# EAGLE schematic VoltageRegulator (EAGLE 7.2.0)
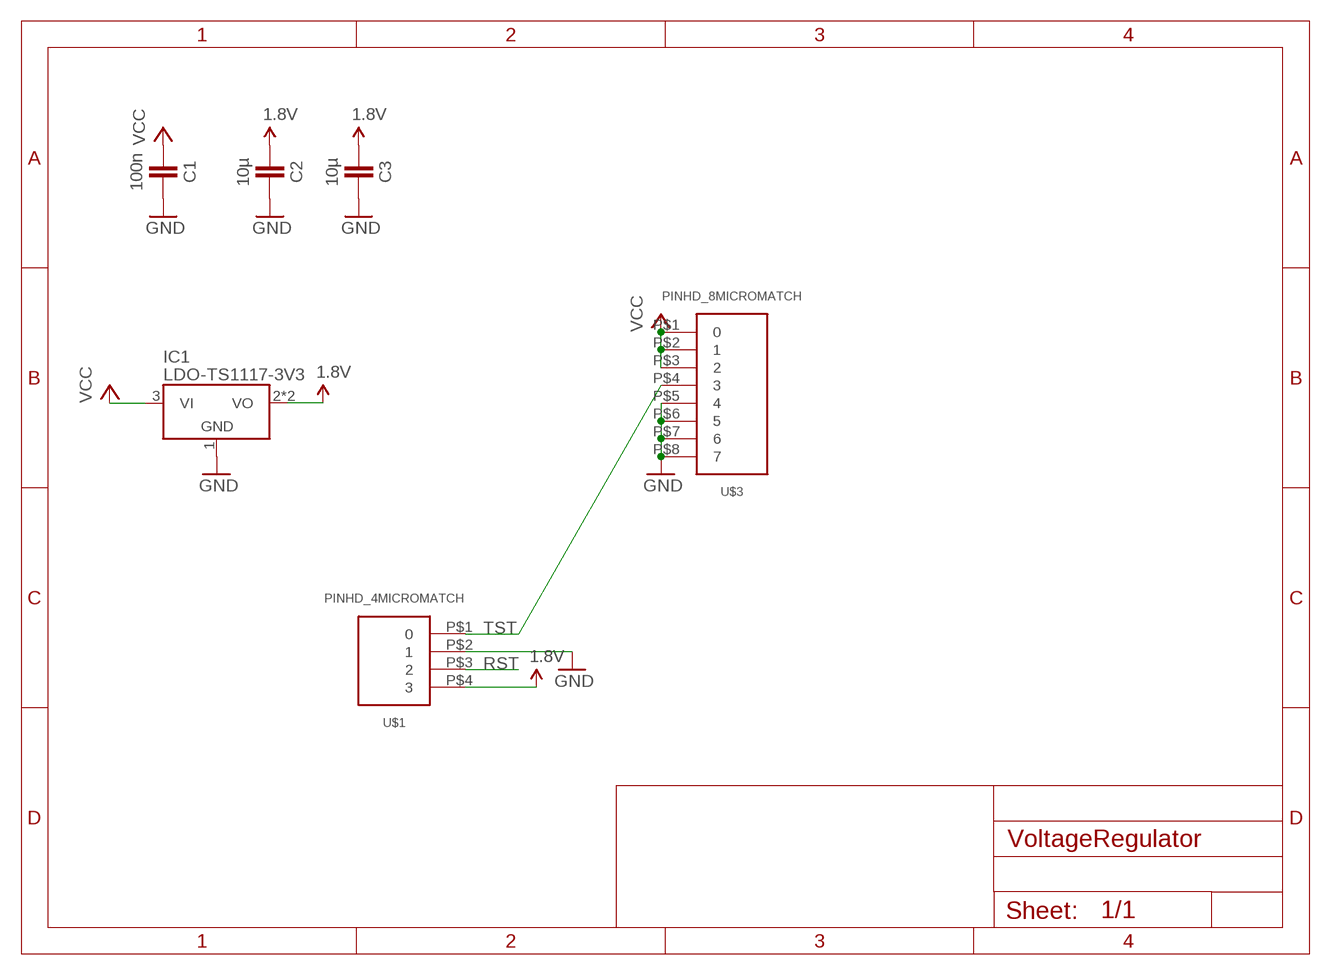
[diagram p0: schematic, sheet 1]

## Parts
C1  100n  CAPACITOR1206  [1206]
C2  10µ  CAPACITOR1206  [1206]
C3  10µ  CAPACITOR1206  [1206]
IC1  LDO-TS1117-3V3  [SOT223]
U$1  PINHD_4MICROMATCH  [MICROMATCH4P0L]
U$3  PINHD_8MICROMATCH  [MICROMATCH8POL]

## Nets
1.8V: C2.1 C3.1 IC1.2(VO) IC1.4(VO) U$1.P$4
GND: C1.2 C2.2 C3.2 IC1.1(GND) U$1.P$2 U$3.P$5 U$3.P$6 U$3.P$7 U$3.P$8
RST: U$1.P$3
TST: U$1.P$1 U$3.P$4
VCC: C1.1 IC1.3(VI) U$3.P$1 U$3.P$2 U$3.P$3

## Library data of the parts
C1-C3 = thar:CAPACITOR
IC1 = we-power:LDO: LDOs TS1117 800mA, Vin max 12V TS5204 150mA, Vin max 16V TS9011 250mA, Vin max 12V compatible AP2210 300mA, Vin max 15V
U$1 = thar:PINHD_4
U$3 = thar:PINHD_8: FCI - 10114828-10108LF - STIFTLEISTE, 1.25MM, SMT, 8POL Farnell Best.Nr.: 2100732 Herst.Bez.: 10114828-10108LF